# EAGLE design KeyBoy (EAGLE 9.5.2)

## Sheet 1 of 2
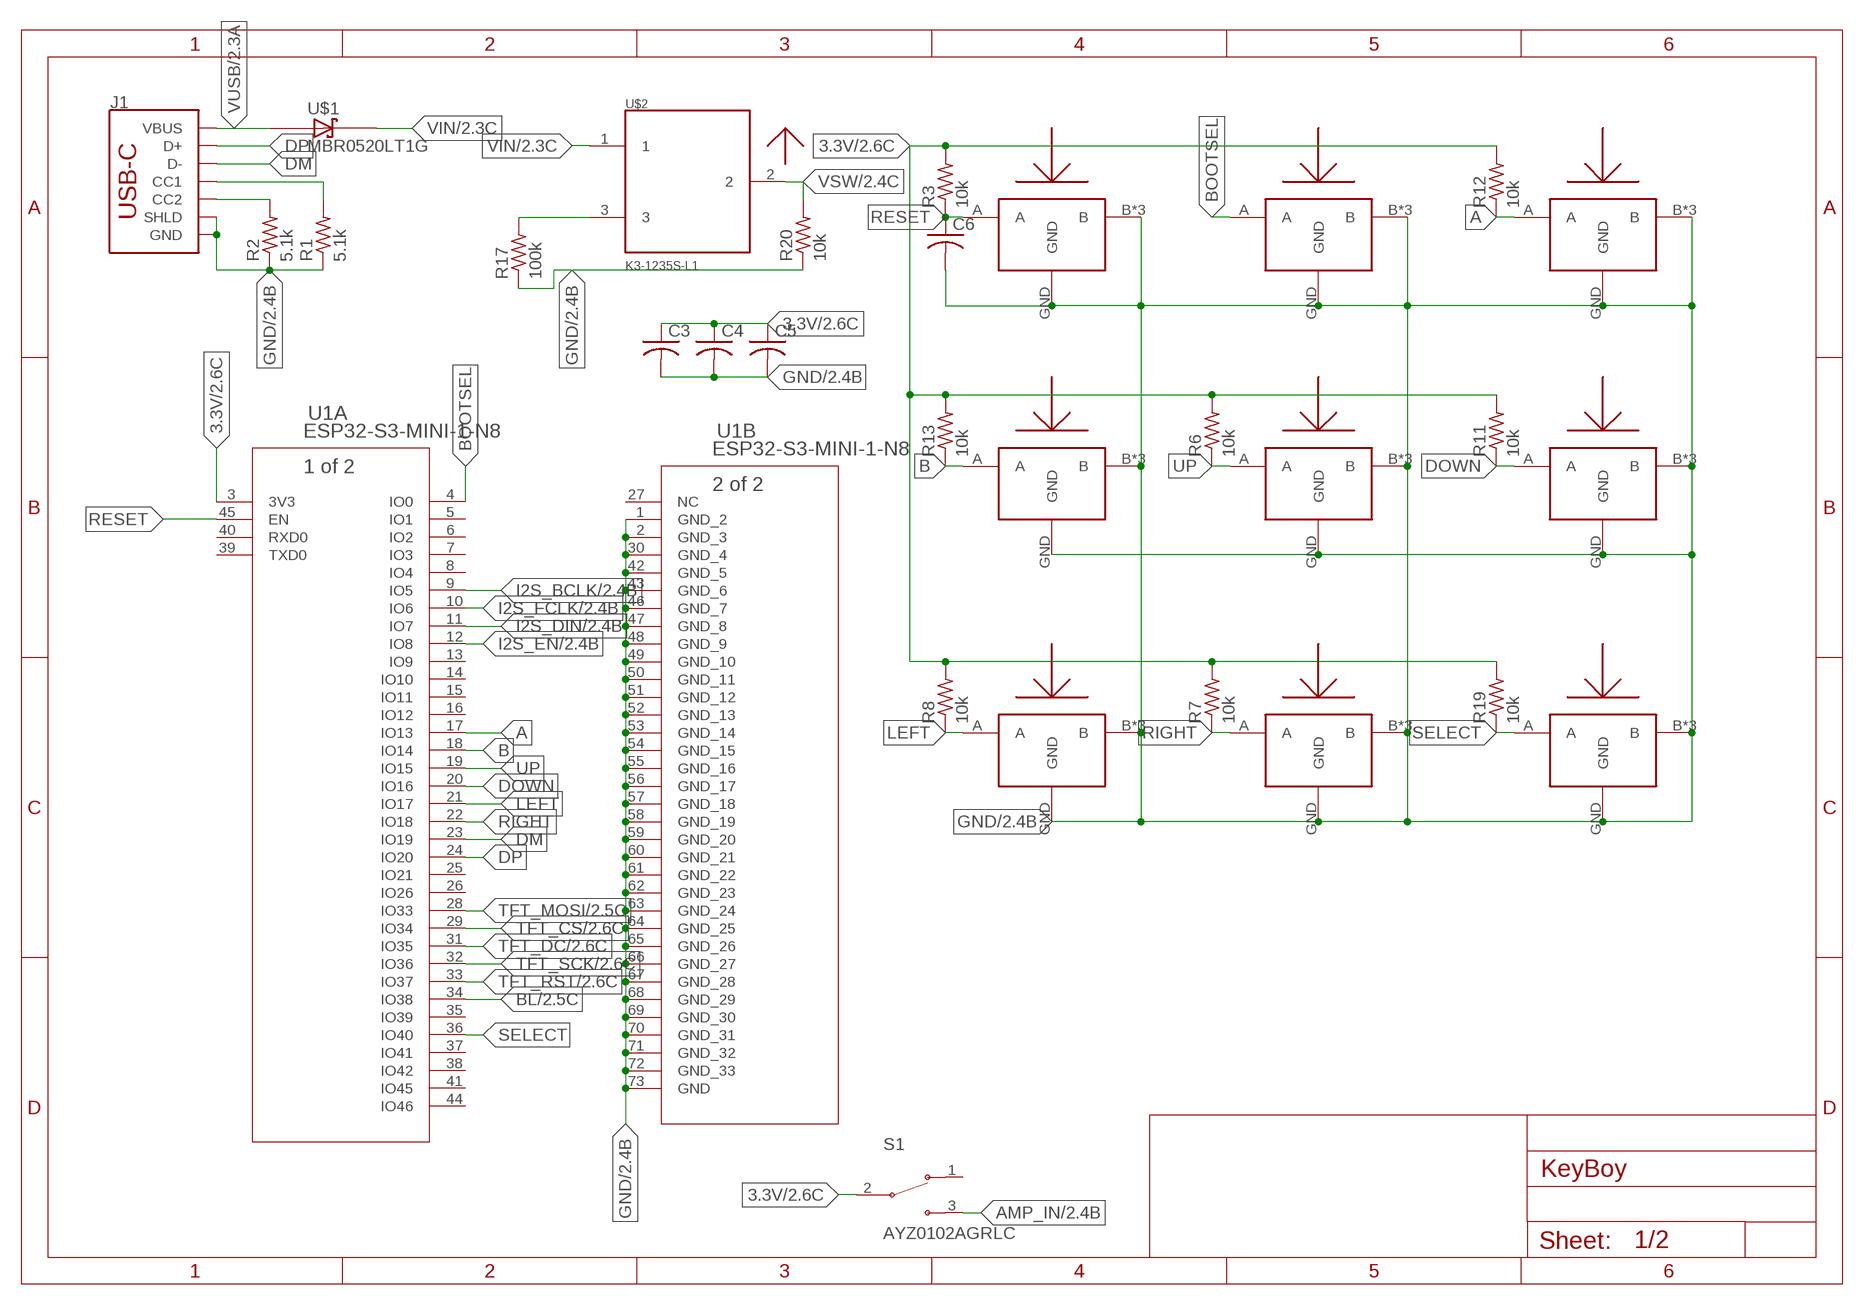
[diagram p0: schematic, sheet 1]

### Parts
A  SOF-232HST  [3.3X2.9]
B  SOF-232HST  [3.3X2.9]
BOOTSEL  SOF-232HST  [3.3X2.9]
C3  C-USC0402  [C0402]
C4  C-USC0402  [C0402]
C5  C-USC0402  [C0402]
C6  C-USC0402  [C0402]
DOWN  SOF-232HST  [3.3X2.9]
J1  USB_C_2-LAYER_PADS  [USB-C-16P-2LAYER-PADS]
LEFT  SOF-232HST  [3.3X2.9]
R1  5.1k  R-US_R0402  [R0402]
R2  5.1k  R-US_R0402  [R0402]
R3  10k  R-US_R0402  [R0402]
R6  10k  R-US_R0402  [R0402]
R7  10k  R-US_R0402  [R0402]
R8  10k  R-US_R0402  [R0402]
R11  10k  R-US_R0402  [R0402]
R12  10k  R-US_R0402  [R0402]
R13  10k  R-US_R0402  [R0402]
R17  100k  R-US_R0402  [R0402]
R19  10k  R-US_R0402  [R0402]
R20  10k  R-US_R0402  [R0402]
RESET  SOF-232HST  [3.3X2.9]
RIGHT  SOF-232HST  [3.3X2.9]
S1  AYZ0102AGRLC  [SW_AYZ0102AGRLC]
SELECT  SOF-232HST  [3.3X2.9]
U1  ESP32-S3-MINI-1-N8  ESP32-S2-MINI-1-N4  [ESP32-S2-MINI-1-N4_EXP]
U$1  MBR0520LT1G  [SOD3716X117(SOD-123)]
U$2  K3-1235S-L1  [K3-1235S-L1]
UP  SOF-232HST  [3.3X2.9]

### Nets
3.3V: C3.1 C4.1 C5.1 R3.2 R6.2 R7.2 R8.2 R11.2 R12.2 R13.2 R19.2 S1.2 U1.3(A:3V3) ; also sheet 2
A: A.A R12.1 U1.17(A:IO13)
AMP_IN: S1.3 ; also sheet 2
B: B.A R13.1 U1.18(A:IO14)
BL: U1.34(A:IO38) ; also sheet 2
BOOTSEL: BOOTSEL.A U1.4(A:IO0)
DM: J1.A7(D-) J1.B7(D-) U1.23(A:IO19)
DOWN: DOWN.A R11.1 U1.20(A:IO16)
DP: J1.A6(D+) J1.B6(D+) U1.24(A:IO20)
GND: A.B A.B2(B) A.B3(B) A.GND B.B B.B2(B) B.B3(B) B.GND BOOTSEL.B BOOTSEL.B2(B) BOOTSEL.B3(B) BOOTSEL.GND C3.2 C4.2 C5.2 C6.2 DOWN.B DOWN.B2(B) DOWN.B3(B) DOWN.GND J1.GND J1.GND2(GND) J1.P$1(SHLD) J1.P$2(SHLD) J1.P$3(SHLD) J1.P$4(SHLD) J1.SHLD1(SHLD) J1.SHLD2(SHLD) J1.SHLD3(SHLD) J1.SHLD4(SHLD) LEFT.B LEFT.B2(B) LEFT.B3(B) LEFT.GND R1.1 R2.1 R17.1 R20.1 RESET.B RESET.B2(B) RESET.B3(B) RESET.GND RIGHT.B RIGHT.B2(B) RIGHT.B3(B) RIGHT.GND SELECT.B SELECT.B2(B) SELECT.B3(B) SELECT.GND U1.1(B:GND_2) U1.2(B:GND_3) U1.30(B:GND_4) U1.42(B:GND_5) U1.43(B:GND_6) U1.46(B:GND_7) U1.47(B:GND_8) U1.48(B:GND_9) U1.49(B:GND_10) U1.50(B:GND_11) U1.51(B:GND_12) U1.52(B:GND_13) U1.53(B:GND_14) U1.54(B:GND_15) U1.55(B:GND_16) U1.56(B:GND_17) U1.57(B:GND_18) U1.58(B:GND_19) U1.59(B:GND_20) U1.60(B:GND_21) U1.61(B:GND_22) U1.62(B:GND_23) U1.63(B:GND_24) U1.64(B:GND_25) U1.65(B:GND_26) U1.66(B:GND_27) U1.67(B:GND_28) U1.68(B:GND_29) U1.69(B:GND_30) U1.70(B:GND_31) U1.71(B:GND_32) U1.72(B:GND_33) U1.73(B:GND) UP.B UP.B2(B) UP.B3(B) UP.GND ; also sheet 2
I2S_BCLK: U1.9(A:IO5) ; also sheet 2
I2S_DIN: U1.11(A:IO7) ; also sheet 2
I2S_EN: U1.12(A:IO8) ; also sheet 2
I2S_FCLK: U1.10(A:IO6) ; also sheet 2
LEFT: LEFT.A R8.1 U1.21(A:IO17)
N$3: J1.A5(CC1) R1.2
N$4: J1.B5(CC2) R2.2
N$6: R17.2 U$2.3
RESET: C6.1 R3.1 RESET.A U1.45(A:EN)
RIGHT: R7.1 RIGHT.A U1.22(A:IO18)
SELECT: R19.1 SELECT.A U1.36(A:IO40)
TFT_CS: U1.29(A:IO34) ; also sheet 2
TFT_DC: U1.31(A:IO35) ; also sheet 2
TFT_MOSI: U1.28(A:IO33) ; also sheet 2
TFT_RST: U1.33(A:IO37) ; also sheet 2
TFT_SCK: U1.32(A:IO36) ; also sheet 2
UP: R6.1 U1.19(A:IO15) UP.A
VIN: U$1.1(C) U$2.1 ; also sheet 2
VSW: R20.2 U$2.2 ; also sheet 2
VUSB: J1.VBUS1(VBUS) J1.VBUS2(VBUS) U$1.2(A) ; also sheet 2
Unconnected: S1.1 U1.5(A:IO1) U1.6(A:IO2) U1.7(A:IO3) U1.8(A:IO4) U1.13(A:IO9) U1.14(A:IO10) U1.15(A:IO11) U1.16(A:IO12) U1.25(A:IO21) U1.26(A:IO26) U1.27(B:NC) U1.35(A:IO39) U1.37(A:IO41) U1.38(A:IO42) U1.39(A:TXD0) U1.40(A:RXD0) U1.41(A:IO45) U1.44(A:IO46)

## Sheet 2 of 2
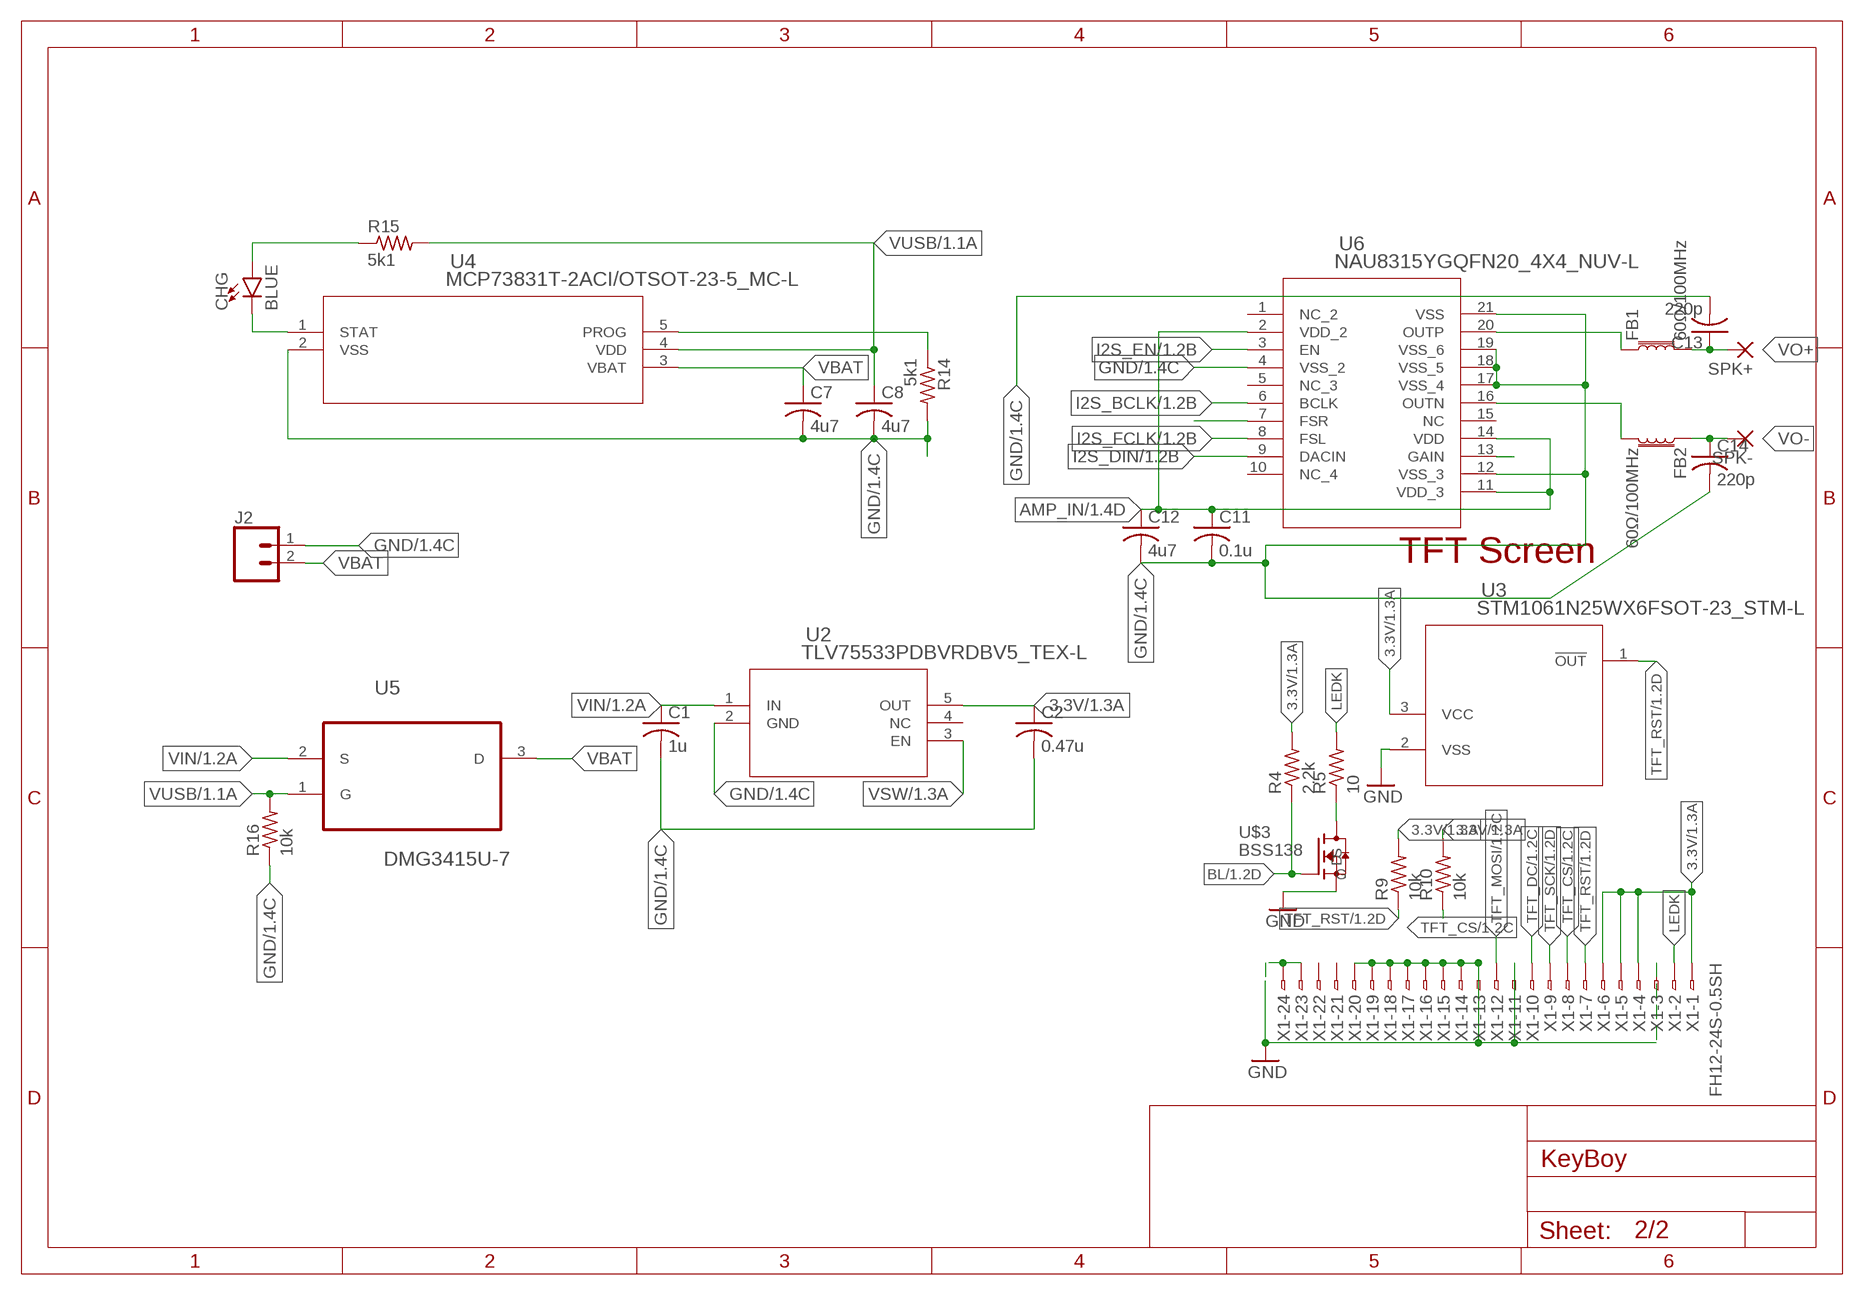
[diagram p1: schematic, sheet 2]

### Parts
C1  1u  C-USC0402  [C0402]
C2  0.47u  C-USC0402  [C0402]
C7  4u7  C-USC0603  [C0603]
C8  4u7  C-USC0603  [C0603]
C11  0.1u  C-USC0603  [C0603]
C12  4u7  C-USC0603  [C0603]
C13  220p  C-USC0603  [C0603]
C14  220p  C-USC0603  [C0603]
CHG  BLUE  LED0603  [LED-0603]
FB1  60Ω/100MHz  FERRITE_BEAD-0603  [0603]
FB2  60Ω/100MHz  FERRITE_BEAD-0603  [0603]
J2  CONN_02-JST-2MM-SMT  [JST-2-SMD]
R4  2.2k  R-US_R0603  [R0603]
R5  10  R-US_R0402  [R0402]
R9  10k  R-US_R0402  [R0402]
R10  10k  R-US_R0402  [R0402]
R14  5k1  R-US_R0603  [R0603]
R15  5k1  R-US_R0603  [R0603]
R16  10k  R-US_R0402  [R0402]
SPK+  SMD5  [SMD2,54-5,08]
SPK-  SMD5  [SMD2,54-5,08]
U2  TLV75533PDBVRDBV5_TEX-L  [DBV5_TEX-L]
U3  STM1061N25WX6FSOT-23_STM-L  [SOT-23_STM-L]
U4  MCP73831T-2ACI/OTSOT-23-5_MC-L  [SOT-23-5_MC-L]
U5  DMG3415U-7  [SOT95P240X105-3N]
U6  NAU8315YGQFN20_4X4_NUV-L  [QFN20_4X4_NUV-L]
U$3  BSS138  [BSS138]
X1  FH12-24S-0.5SH  [FH12-24S-0.5SH]

### Nets
3.3V: C2.1 R4.2 R9.2 R10.2 U2.5(OUT) U3.3(VCC) X1.1 X1.4 X1.5 X1.6 ; also sheet 1
AMP_IN: C11.1 C12.1 U6.2(VDD_2) U6.11(VDD_3) U6.14(VDD) ; also sheet 1
BL: R4.1 U$3.G ; also sheet 1
GND: C1.2 C2.2 C7.2 C8.2 C11.2 C12.2 C13.2 C14.2 J2.1 R14.2 R16.1 U2.2(GND) U3.2(VSS) U4.2(VSS) U6.4(VSS_2) U6.12(VSS_3) U6.17(VSS_4) U6.18(VSS_5) U6.19(VSS_6) U6.21(VSS) U$3.S X1.3 X1.11 X1.13 X1.14 X1.15 X1.16 X1.17 X1.18 X1.19 X1.20 X1.23 X1.24 ; also sheet 1
I2S_BCLK: U6.6(BCLK) ; also sheet 1
I2S_DIN: U6.9(DACIN) ; also sheet 1
I2S_EN: U6.3(EN) ; also sheet 1
I2S_FCLK: U6.8(FSL) ; also sheet 1
LEDK: R5.2 X1.2
N$1: R14.1 U4.5(PROG)
N$5: FB1.1 U6.20(OUTP)
N$7: R5.1 U$3.D
N$8: FB2.2 U6.16(OUTN)
N$9: CHG.C U4.1(STAT)
N$10: CHG.A R15.1
N$14: U6.7(FSR)
N$17: U6.13(GAIN)
TFT_CS: R10.1 X1.8 ; also sheet 1
TFT_DC: X1.10 ; also sheet 1
TFT_MOSI: X1.12 ; also sheet 1
TFT_RST: R9.1 U3.1(!OUT) X1.7 ; also sheet 1
TFT_SCK: X1.9 ; also sheet 1
VBAT: C7.1 J2.2 U4.3(VBAT) U5.3(D)
VIN: C1.1 U2.1(IN) U5.2(S) ; also sheet 1
VO+: C13.1 FB1.2 SPK+.1(P)
VO-: C14.1 FB2.1 SPK-.1(P)
VSW: U2.3(EN) ; also sheet 1
VUSB: C8.1 R15.2 R16.2 U4.4(VDD) U5.1(G) ; also sheet 1
Unconnected: U2.4(NC) U6.1(NC_2) U6.5(NC_3) U6.10(NC_4) U6.15(NC) X1.21 X1.22

### Notes on the sheet
- TFT Screen

## Library data of the parts
A B BOOTSEL DOWN LEFT RESET RIGHT SELECT UP = Mitsumi Buttons:SOF-232HST
C1-C8 C11-C14 = rcl:C-US: CAPACITOR, American symbol; SPICEPREFIX: C
CHG = SparkFun-LED:LED: LED (Generic) Standard schematic elements and footprints for 5mm, 3mm, 1206, and 0603 sized LEDs. Generic LEDs with no color specified.
FB1 FB2 = SparkFun-Coils:FERRITE_BEAD: Ferrite Bead (blocks, cores, rings, chokes, etc.) Inductor with layers of ferrite used to suppress high frequencies. Often used to isolate high frequency noise. SparkFun Products: IOIO-OTG - V2.2 <https://www.sparkfun.com/products/13613> SparkFun SAMD21 Mini Breakout <https://www.sparkfun.com/products/13664> SparkFun 6 Degrees of Freedom Breakout - LSM6DS3 <https://www.sparkfun.com/products/13339> SparkFun SAMD21 Dev Breakout <https://www.sparkfun.com/products/13672>; PROD_ID: NDUC-13805; VALUE: 30Ω/1.8A
J1 = SparkFun-Connectors:USB_C: USB Type C 16Pin Connector Super Speed pins not available on the 16-pin purely SMD connector so this part is best for USB 2.0 implementations. D1 and D2 are tied together enabling D+/- no matter which way the cable is plugged into the connector. The two channel configuration pins (CC1/2) are exposed. These are normally connected to ground via 5.1k resistors but can be reconfigured for high current/high power applications.; PROD_ID: CONN-14122
J2 = SparkFun-Connectors:CONN_02: Multi connection point. Often used as Generic Header-pin footprint for 0.1 inch spaced/style header connections On any of the 0.1 inch spaced packages, you can populate with these: Break Away Headers - Straight <https://www.sparkfun.com/products/116> (PRT-00116) Break Away Male Headers - Right Angle <https://www.sparkfun.com/products/553> (PRT-00553) Female Headers <https://www.sparkfun.com/products/115> (PRT-00115) Break Away Headers - Machine Pin <https://www.sparkfun.com/products/117> (PRT-00117) Break Away Female Headers - Swiss Machine Pin <https://www.sparkfun.com/products/743> (PRT-00743) For SCREWTERMINALS and SPRING TERMINALS visit here: Screw Terimnals on SparkFun.com <https://www.sparkfun.com/search/results?term=Screw+Terminals> (5mm/3.5mm/2.54mm spacing) This device is also useful as a general connection point to wire up your design to another part of your project. Our various solder wires solder well into these plated through hole pads. Hook-Up Wire - Assortment (Stranded, 22 AWG) <https://www.sparkfun.com/products/11375> (PRT-11375) Hook-Up Wire - Assortment (Solid Core, 22 AWG) <https://www.sparkfun.com/products/11367> (PRT-11367) View the entire wire category on our website here <https://www.sparkfun.com/categories/141> Special notes: Molex polarized connector foot print use with: PRT-08233 with associated crimp pins and housings. 2.54_SCREWTERM for use with PRT-10571. 3.5mm Screw Terminal footprints for PRT-08084 5mm Screw Terminal footprints for use with PRT-08432; PROD_ID: CONN-11443
R1-R17 R19 R20 = rcl:R-US_: RESISTOR, American symbol; SPICEPREFIX: R
S1 = AYZ0102AGRLC:AYZ0102AGRLC: Switch Slide ON ON SPDT Side Slide 0.1A 12VDC 1.2VA 10000Cycles Gull Wing SMD T/R Check availability <https://pricing.snapeda.com/parts/AYZ0102AGRLC/C%26K/view-part?ref=eda>; AVAILABILITY: In Stock; DESCRIPTION: Slide Switch SPDT Surface Mount, Right Angle; MF: C&K; MP: AYZ0102AGRLC; PACKAGE: None; PRICE: None; PURCHASE-URL: https://pricing.snapeda.com/search/part/AYZ0102AGRLC/?ref=eda
SPK+ SPK- = wirepad:SMD5: SMD PAD
U1 = ESP32-S2-MINI:ESP32-S2-MINI-1-N4; COPYRIGHT: Copyright (C) 2021 Ultra Librarian. All rights reserved.; DIGI-KEY_PART_NUMBER_1: 1965-ESP32-S2-MINI-1-N4-ND; MANUFACTURER_PART_NUMBER: ESP32-S2-MINI-1-N4; MFR_NAME: Espressif Systems
U2 = TLV75533pdbvr:TLV75533PDBVR; COPYRIGHT: Copyright (C) 2018 Accelerated Designs. All rights reserved; MANUFACTURER_PART_NUMBER: TLV75533PDBVR; SOURCELIBRARY: TI_2019-06-18; VENDOR: Texas Instruments
U3 = STM Devices:STM1061N25WX6F; COPYRIGHT: Copyright (C) 2021 Ultra Librarian. All rights reserved.; DIGI-KEY_PART_NUMBER_1: 1026-STM1061N25WX6F-CHP; DIGI-KEY_PART_NUMBER_2: 497-6181-1-ND; DIGI-KEY_PART_NUMBER_3: 497-6181-2-ND; DIGI-KEY_PART_NUMBER_4: 497-6181-6-ND; MANUFACTURER_PART_NUMBER: STM1061N25WX6F; MFR_NAME: STMicroelectronics
U4 = MCP73831-2ACI:MCP73831T-2ACI/OT; BUILT_BY: EMA_UL_Team; MANUFACTURER_PART_NUMBER: MCP73831T-2ACI/OT; VENDOR: Microchip
U5 = DMG3415U-7:DMG3415U-7: P-CHANNEL ENHANCEMENT MODE MOSFET; AVAILABILITY: Unavailable; DESCRIPTION: P-Channel 20V 4A _Ta_ 900mW _Ta_ Surface Mount SOT-23-3; MF: Diodes Inc.; MP: DMG3415U-7; PACKAGE: SOT-23-3 Diodes Inc.; PRICE: None
U6 = NAU8315YG:NAU8315YG; COPYRIGHT: Copyright (C) 2023 Ultra Librarian. All rights reserved.; MANUFACTURER_PART_NUMBER: NAU8315YG; MFR_NAME: Nuvoton
U$1 = MBR0520LT1G:MBR0520LT1G: Surface Mount Schottky Power Rectifier Plastic SOD−123 Package; AVAILABILITY: Unavailable; DESCRIPTION: Diode Schottky 20V 500mA Surface Mount SOD-123; MF: ON Semiconductor; MP: MBR0520LT1G; PACKAGE: SOD-123 ON Semiconductor; PRICE: None
U$2 = KS Switches:K3-1235S-L1
U$3 = BSS138:BSS138: BSS138 N-Channel Logic Level Enhancement Mode Field Effect Transistor; AVAILABILITY: Unavailable; DESCRIPTION: N-Channel 50V 220mA _Ta_ 360mW _Ta_ Surface Mount Die; MF: MICROSS/On Semiconductor; MP: BSS138; PACKAGE: TO-236-3 Micross; PRICE: None
X1 = con-hirose:FH12-24S-0.5S: 0.5mm Pitch Connectors For FPC/FFC Source: Data sheet <http://www.hirose.co.jp/cataloge_hp/e58605370.pdf>; MPN: FH12-24S-0.5SH(55); OC_FARNELL: 1324552; OC_NEWARK: 34M6170

## Board
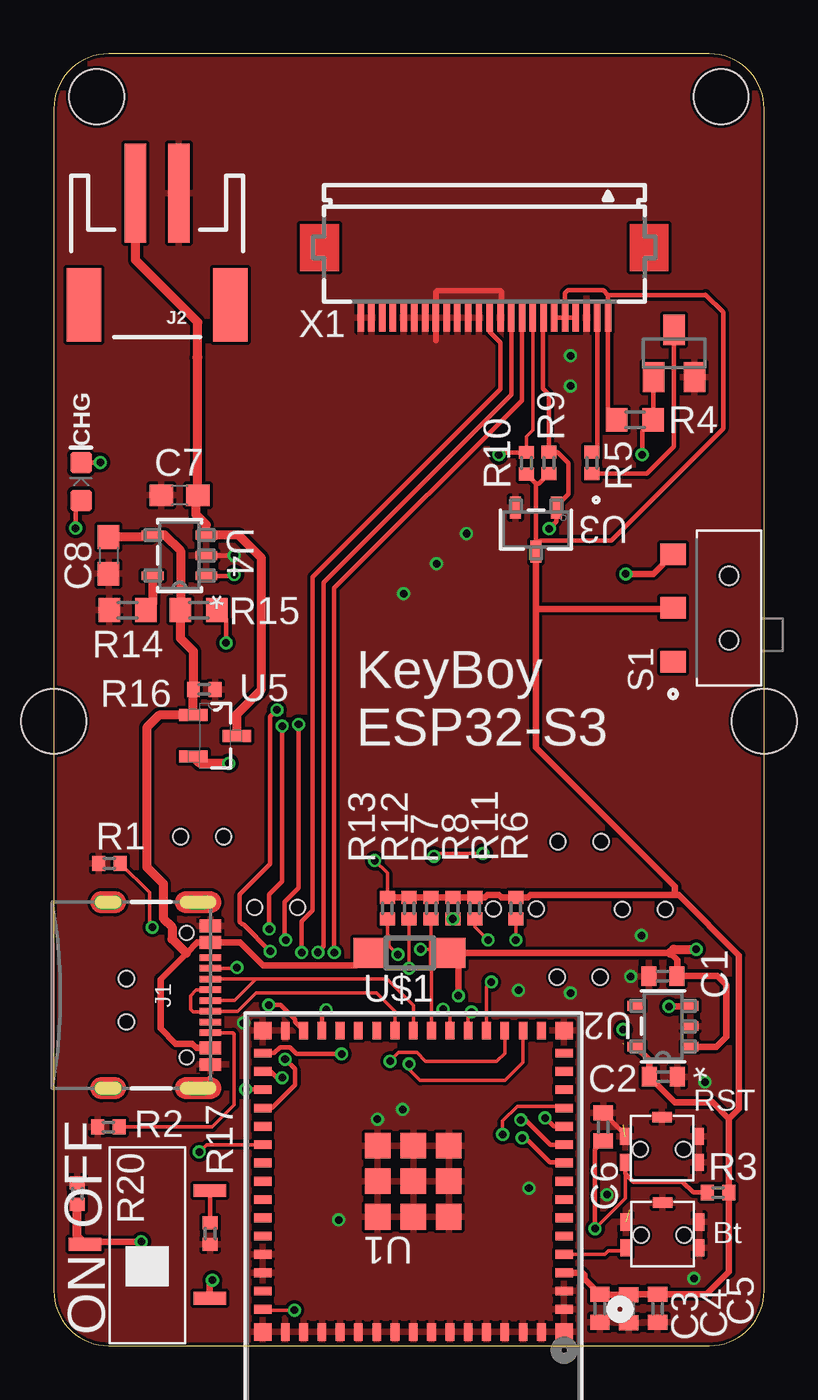
[diagram p2: board, top side]
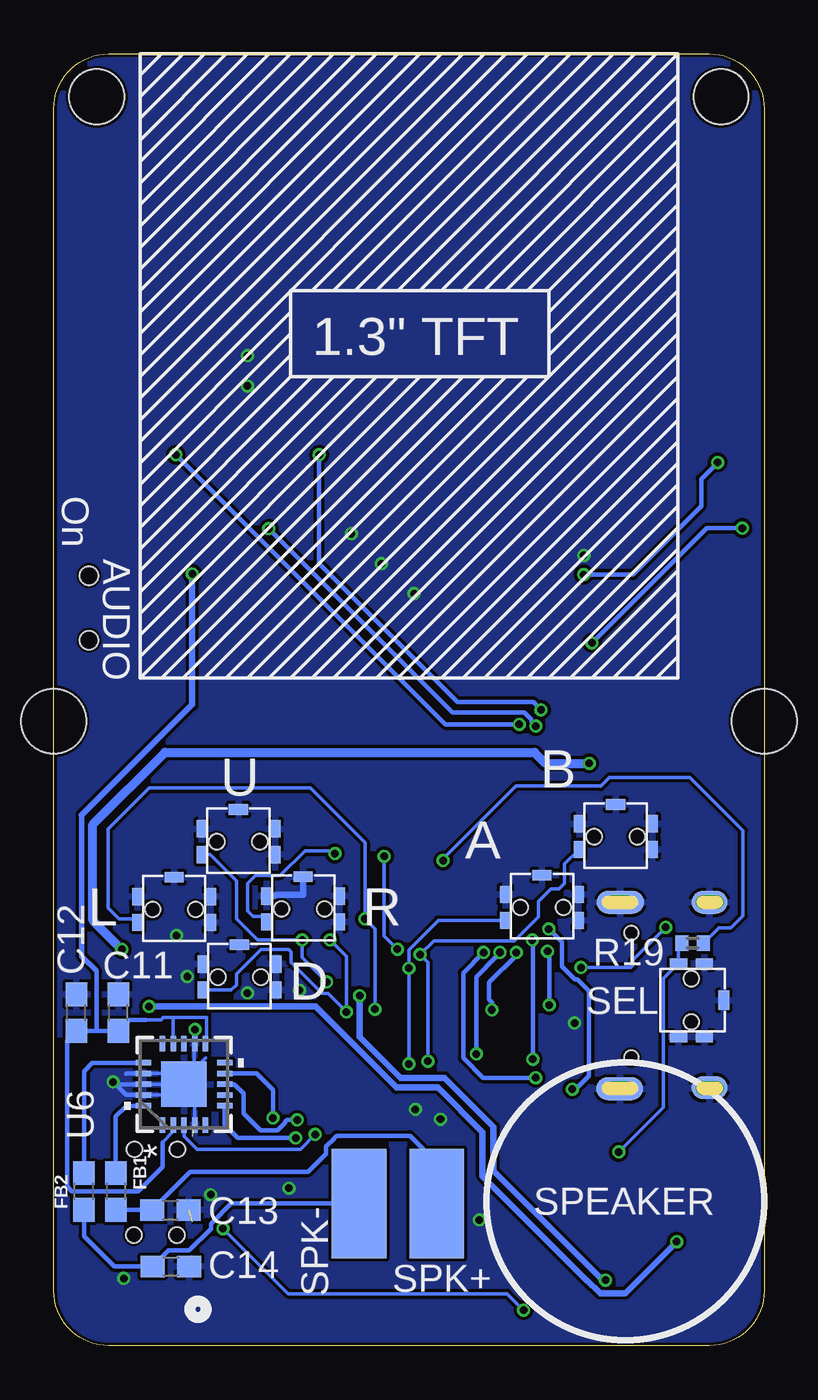
[diagram p3: board, bottom side, seen from below]

Size 33 x 60 mm. Coordinates in mm from the lower left corner, seen from the top.
Outline: 0,57.46 0,2.54 arc90 2.54,0 30.46,0 arc90 33,2.54 33,57.46 arc90 30.46,60 2.54,60 arc90 0,57.46
Copper layers (1*16): Top 0.035mm / dielectric 1.5mm / Bottom 0.035mm
Design rules "default *": minimum track width 6mil, minimum drill 0.35mm, track to track 6mil, track to pad 6mil, pad to pad 6mil, via to via 6mil, smd to smd 6mil, copper to edge 6mil, drill to drill 6mil, minimum pad ring 5mil, minimum via ring 5mil, stop-mask expansion 1mil, vias tented up to drill 14mil, thermal gap 6mil
Holes 2.54 mm at 2,58 31,58
Holes 3 mm at 0,29 33,29

### Footprints (pad centres in the part's own frame; a part is rotated, then mirrored left to right if it is on the bottom)
3.3X2.9 = smd 0.5 x 0.8: A -0.7,-0.6; B2 2.7,0.6; B3 2.7,-0.6; GND -0.7,0.6 | smd 0.9 x 0.5: B 1,1.5 | hole 0.7: 0,0; 2,0
C0402 = smd 0.7 x 0.9: 1 -0.65,0; 2 0.65,0
C0603 = smd 1.1 x 1: 1 -0.85,0; 2 0.85,0
LED-0603 = smd 1 x 1: A -0.877,0; C 0.877,0
0603 = smd 1.1 x 1: 1 -0.85,0; 2 0.85,0
USB-C-16P-2LAYER-PADS = smd 0.3 x 1: A5 -1.25,-0.34; A6 -0.25,-0.34; A7 0.25,-0.34; A8 1.25,-0.34; B5 1.75,-0.34; B6 0.75,-0.34; B7 -0.75,-0.34; B8 -1.75,-0.34 | smd 0.6 x 1: GND -3.225,-0.34; GND2 3.225,-0.34; VBUS1 -2.45,-0.34; VBUS2 2.45,-0.34 | smd 1.067 x 2.184 bottom: P$1 -4.318,-0.94; P$2 4.343,-0.914 | smd 1.067 x 1.676 bottom: P$3 -4.318,-5.08; P$4 4.293,-5.08 | drill 0.4 pad 0.6 long: SHLD1 -4.318,-0.915; SHLD2 4.318,-0.915; SHLD3 -4.318,-5.095; SHLD4 4.318,-5.095 | hole 0.65: -2.89,-1.445; 2.89,-1.445
JST-2-SMD = smd 1 x 4.6: 1 -1,-3.7; 2 1,-3.7 | smd 1.6 x 3.4: NC1 -3.4,1.5; NC2 3.4,1.5
R0402 = smd 0.6 x 0.7: 1 -0.5,0; 2 0.5,0
R0603 = smd 1 x 1.1: 1 -0.85,0; 2 0.85,0
SW_AYZ0102AGRLC = smd 1 x 1.2: 1 -2.5,2.45; 2 0,2.45; 3 2.5,2.45 | hole 0.85: -1.5,-0.15; 1.5,-0.15
SMD2,54-5,08 = smd 2.54 x 5.08: 1 0,0
ESP32-S2-MINI-1-N4_EXP = smd 0.813 x 0.406: 1 -7,3.661; 2 -7,2.811; 3 -7,1.961; 4 -7,1.111; 5 -7,0.261; 6 -7,-0.589; 7 -7,-1.439; 8 -7,-2.289; 9 -7,-3.139; 10 -7,-3.989; 11 -7,-4.839; 12 -7,-5.689; 13 -7,-6.539; 14 -7,-7.389; 15 -7,-8.239; 31 7,-8.239; 32 7,-7.389; 33 7,-6.539; 34 7,-5.689; 35 7,-4.839; 36 7,-3.989; 37 7,-3.139; 38 7,-2.289; 39 7,-1.439; 40 7,-0.589; 41 7,0.261; 42 7,1.111; 43 7,1.961; 44 7,2.811; 45 7,3.661 | smd 0.406 x 0.813: 16 -5.95,-9.289; 17 -5.1,-9.289; 18 -4.25,-9.289; 19 -3.4,-9.289; 20 -2.55,-9.289; 21 -1.7,-9.289; 22 -0.85,-9.289; 23 0,-9.289; 24 0.85,-9.289; 25 1.7,-9.289; 26 2.55,-9.289; 27 3.4,-9.289; 28 4.25,-9.289; 29 5.1,-9.289; 30 5.95,-9.289; 46 5.95,4.711; 47 5.1,4.711; 48 4.25,4.711; 49 3.4,4.711; 50 2.55,4.711; 51 1.7,4.711; 52 0.85,4.711; 53 0,4.711; 54 -0.85,4.711; 55 -1.7,4.711; 56 -2.55,4.711; 57 -3.4,4.711; 58 -4.25,4.711; 59 -5.1,4.711; 60 -5.95,4.711 | smd 1.194 x 1.194: 61 0,-2.289; 66 -1.65,-0.639; 67 0,-0.639; 68 1.65,-0.639; 69 -1.65,-2.289; 70 1.65,-2.289; 71 -1.65,-3.939; 72 0,-3.939; 73 1.65,-3.939 | smd 0.813 x 0.813: 62 -7,4.711; 63 -7,-9.289; 64 7,-9.289; 65 7,4.711
DBV5_TEX-L = smd 0.775 x 0.457: 1 -1.264,0.95; 2 -1.264,0; 3 -1.264,-0.95; 4 1.264,-0.95; 5 1.264,0.95
SOT-23_STM-L = smd 0.508 x 1.016: 1 -0.95,-1.016; 2 0.95,-1.016; 3 0,1.016
SOT-23-5_MC-L = smd 1.016 x 0.406: 1 -1.245,0.95; 2 -1.245,0; 3 -1.245,-0.95; 4 1.245,-0.95; 5 1.245,0.95
SOT95P240X105-3N = smd 1.321 x 0.559: 1 -1.016,0.965; 2 -1.016,-0.965; 3 1.016,0
QFN20_4X4_NUV-L = smd 0.711 x 0.254: 1 -1.892,1; 2 -1.892,0.5; 3 -1.892,0; 4 -1.892,-0.5; 5 -1.892,-1; 11 1.892,-1; 12 1.892,-0.5; 13 1.892,0; 14 1.892,0.5; 15 1.892,1 | smd 0.254 x 0.711: 6 -1,-1.892; 7 -0.5,-1.892; 8 0,-1.892; 9 0.5,-1.892; 10 1,-1.892; 16 1,1.892; 17 0.5,1.892; 18 0,1.892; 19 -0.5,1.892; 20 -1,1.892 | smd 2.108 x 2.108: 21 0,0
SOD3716X117(SOD-123) = smd 1.4 x 1.4: 1 -1.9,0.051; 2 1.9,0.051
K3-1235S-L1 = smd 1.5 x 0.6: 1 -3.5,2.5; 2 2.3,0; 3 -3.5,-2.5
BSS138 = smd 1 x 1.4: D 0,1.1; G -0.95,-1.1; S 0.95,-1.1
FH12-24S-0.5SH = smd 0.3 x 1.3: 1 -5.75,3.25; 2 -5.25,3.25; 3 -4.75,3.25; 4 -4.25,3.25; 5 -3.75,3.25; 6 -3.25,3.25; 7 -2.75,3.25; 8 -2.25,3.25; 9 -1.75,3.25; 10 -1.25,3.25; 11 -0.75,3.25; 12 -0.25,3.25; 13 0.25,3.25; 14 0.75,3.25; 15 1.25,3.25; 16 1.75,3.25; 17 2.25,3.25; 18 2.75,3.25; 19 3.25,3.25; 20 3.75,3.25; 21 4.25,3.25; 22 4.75,3.25; 23 5.25,3.25; 24 5.75,3.25

### Placement (x,y rotation side)
A  11.32,20.35 0 bottom
B  7.89,23.64 0 bottom
BOOTSEL  27.28,5.14 0 top
C1  28.29,17.16 180 top
C2  28.31,12.49 0 top
C3  25.37,1.73 270 top
C4  26.71,1.72 270 top
C5  28.05,1.73 270 top
C6  25.53,10.16 90 top
C7  5.84,39.5 180 top
C8  2.54,36.7 270 top
C11  30,15.47 90 bottom
C12  31.95,15.47 90 bottom
C13  27.58,6.3 0 bottom
C14  27.56,3.68 0 bottom
CHG  1.27,40.13 90 top
DOWN  25.38,17.12 0 bottom
FB1  30.12,7.16 270 bottom
FB2  31.6,7.16 90 bottom
J1  7.62,16.28 270 top
J2  4.8,49.83 180 top
LEFT  28.41,20.26 0 bottom
R1  2.59,22.4 0 top
R2  2.54,10.16 0 top
R3  30.86,7.11 0 top
R4  27,43 180 top
R5  25,41 90 top
R6  21.46,20.32 90 top
R7  17.53,20.32 90 top
R8  18.54,20.32 90 top
R9  23,41 270 top
R10  21.96,40.99 270 top
R11  19.56,20.32 90 top
R12  16.51,20.32 90 top
R13  15.49,20.32 90 top
R14  3.43,34.16 180 top
R15  6.73,34.16 180 top
R16  6.99,30.48 180 top
R17  7.26,5.21 90 top
R19  3.33,18.69 0 bottom
R20  1.09,7.06 270 top
RESET  27.25,9.12 0 top
RIGHT  22.42,20.28 0 bottom
S1  31.22,34.26 90 top
SELECT  3.38,17.04 270 bottom
SPK+  15.21,6.6 0 bottom
SPK-  18.82,6.6 0 bottom
U1  16.7,5.35 180 top
U2  28.3,14.84 180 top
U3  22.4,37.9 180 top
U4  5.84,36.7 180 top
U5  7.49,28.32 0 top
U6  26.95,12.14 90 bottom
U$1  16.53,18.29 180 top
U$2  3.75,4.7 180 top
U$3  28.81,46.08 0 top
UP  25.42,23.41 0 bottom
X1  20,51 180 top

### Tracks (layer width: path | path; a pad name or v marks a point on that pad's centre or on a via)
3.3V  (via drill 0.35)
  Top 0.152: v14.91,22.53 15.49,21.95 R13.2
  Top 0.203: R4.2 25.75,43.4 X1.1 25.75,48.8 | X1.5 23.75,48.9 23.88,49.02 25.53,49.02 25.75,48.8 | X1.6 X1.5 | X1.5 X1.4 | U3.3 22.4,37.19 | 22.4,37.19 22.4,39.37 22.4,40.05 | 22.4,40.05 R10.2 | R9.2 22.55,40.05 22.4,40.05 | 25.75,48.8 30.26,48.8 30.28,48.82 31.1,47.99 31.1,42.58 25.91,37.39 22.61,37.39 22.4,37.19
  Top 0.305: U2.5 27.66,13.26 C2.1 28.85,11.3 30.61,11.3 31.37,10.54 | 31.37,10.54 31.37,7.09 31.37,3.43 30.32,2.38 C5.1 26.72,2.38 C4.1 25.38,2.37 C3.1 24.64,3.12 24.64,3.3 24.55,3.39 U1.3 | 31.37,10.54 31.83,11 31.83,18.14 29.02,20.94 28.86,20.94 | 28.86,20.94 22.15,20.94 22.03,20.82 R6.2 20.81,20.82 20.69,20.94 20.15,20.94 20.03,20.82 R11.2 R8.2 R7.2 R12.2 R13.2 | 28.86,20.94 28.86,21.33 22.4,27.79 22.4,34.21 | 22.4,34.21 U3.3 | S1.2 28.72,34.21 22.4,34.21
  Top 0.406: R3.2 31.37,7.09
  Bottom 0.152: R19.2 2.12,19.41 1.55,19.41 0.99,19.96 0.99,23.93 3.45,26.39 7.19,26.39 7.59,25.98 11.53,25.98 14.91,22.61 v14.91,22.53
A  (via drill 0.35)
  Top 0.152: U1.17 21.8,13.16 20.95,12.32 17.02,12.32 16.51,12.83 v16.51,13.08 | v16.51,17.53 R12.1
  Bottom 0.152: v16.51,13.08 v16.51,17.53 16.51,18.38 15.14,19.75 A.A
AMP_IN  (via drill 0.35)
  Top 0.305: S1.3 27.84,35.84 v26.57,35.84
  Bottom 0.152: 28.7,15.14 28.02,15.14 27.91,15.24 27.46,15.24 | 27.94,9.45 27.45,9.94 U6.2 | U6.11 25.91,14.07 25.91,15.24 27.46,15.24 | 27.46,15.24 27.45,15.23 U6.14
  Bottom 0.203: 28.7,15.14 29.48,15.14 C11.1 31.01,14.62 | 31.01,14.62 C12.1 32.38,14.19 32.38,7.39 32.16,7.17 29.08,7.17 27.94,8.3 27.94,9.45 | 31.01,14.62 31.01,17.4 31.06,17.45
  Bottom 0.254: 31.06,17.45 31.7,18.09 31.7,24.64
  Bottom 0.305: v26.57,35.84 26.57,29.77 31.7,24.64
B  (via drill 0.35)
  Top 0.152: U1.18 20.95,13.58 20.57,13.21 17.27,13.21 16.87,13.61 16.02,13.61 v15.62,13.21 | v15.98,18.16 15.56,18.58 15.56,19.03 15.49,19.1 R13.1
  Bottom 0.152: v15.62,13.21 15.62,17.8 v15.98,18.16 15.34,18.8 11.61,18.8 10.49,19.91 10.49,20.62 9.91,21.21 9.53,21.21 9.27,21.46 9.27,22.36 B.A
BL  (via drill 0.35)
  Top 0.203: U$3.G 27.86,43.01 R4.1 27.33,42.48 v27.33,41.38 | v11.37,28.85 11.37,21.26 10.72,20.6 10.72,18.9 v10.77,18.84 | U1.34 9.71,11.05 10.13,11.05 11.2,12.12 11.2,12.85 v10.74,13.31
  Bottom 0.203: v27.33,41.38 14.81,28.85 v11.37,28.85 | v10.74,13.31 10.74,18.82 v10.77,18.84
BOOTSEL
  Top 0.152: U1.4 25.6,4.24 25.76,4.4 26.44,4.4 BOOTSEL.A
DM
  Top 0.152: U1.23 16.7,15.81 15.48,17.03 9.53,17.03 9.41,17.03 | 9.41,17.03 J1.B7 | J1.A7 8.41,16.03 9.41,17.03
DOWN  (via drill 0.35)
  Top 0.152: U1.20 19.25,15.34 v19.4,15.49 | v20.17,18.84 19.56,19.46 R11.1
  Bottom 0.152: v20.17,18.84 19.4,18.07 v19.4,15.49 20.27,16.36 20.54,16.36 21.97,17.79 21.97,18.29 22.1,18.41 23.37,18.41 24.51,17.27 24.51,16.76 24.75,16.52 DOWN.A
DP
  Top 0.152: U1.24 15.85,15.52 14.99,16.38 9.4,16.38 8.54,15.53 J1.B6 7.25,15.49 6.48,15.49 6.35,15.62 6.35,16.26 6.62,16.53 J1.A6
GND  (via drill 0.35)  (3 unrouted)
  Top 0.152: J1.GND2 7.28,12.54 J1.SHLD2
  Top 0.203: C6.2 26.55,9.78 RESET.GND | U4.2 v8.38,36.7
  Top 0.254: X1.11 20.8,47.8 20.8,48.92 20.73,49 17.8,49 17.75,48.94 X1.17 17.75,46.69
  Bottom 0.152: 26.49,13.99 26.49,12.83 | 26.49,12.83 26.49,12.6 26.86,12.23 26.45,11.82 U6.4 | 25.95,13.37 26.49,12.83 | U6.17 28.28,12.64 28.27,12.65 27.46,12.65 27.06,12.26 | 27.06,12.26 U6.21 | U6.18 27.43,12.14 | 27.43,12.14 27.18,12.14 27.06,12.26 | U6.19 27.93,11.64 27.43,12.14
  Bottom 0.203: U6.12 26.45,14.64 26.47,14.66 | U6.17 29.62,12.64 29.64,12.62 | U6.18 30.15,12.14 v30.25,12.24 29.65,11.64 U6.19
  Bottom 0.305: RIGHT.GND 22.74,20.88 22.69,20.94 21.42,20.94 RIGHT.B
  other vias: 21.59,16.51 16.21,10.97 15.04,10.52 13.23,5.84 8.81,14.99 26.8,17.14 27.3,19.05 25.7,7.01 29.74,3.12 24,16.38 24,45.97 24,44.58 16.26,34.92 17.78,36.32 19.18,37.72 22.07,7.32
  pour Top: 35.56,62.23 -2.54,62.23 -2.54,-2.54 35.56,-2.54
  pour Bottom: 36.83,64.14 -3.81,64.14 -3.81,-3.81 36.83,-3.81
I2S_BCLK  (via drill 0.35)
  Top 0.203: U1.9 23.66,8.53 23.04,8.53 21.91,9.65 v21.76,9.65
  Bottom 0.203: v21.76,9.65 24.46,9.65 25.06,10.25 U6.6
I2S_DIN  (via drill 0.35)
  Top 0.203: U1.11 23.24,10.19 23.23,10.2 23.2,10.2 v22.82,10.58
  Bottom 0.203: v22.82,10.58 22.82,11.87 23.59,12.64 U6.9
I2S_EN  (via drill 0.35)
  Top 0.152: U1.12 23.62,11.12 21.53,11.12 20.85,10.44 v20.85,9.8
  Bottom 0.152: U6.3 26.95,9.73 26.34,9.12 21.54,9.12 v20.85,9.8
I2S_FCLK  (via drill 0.35)
  Top 0.203: U1.10 23.69,9.32 23.06,9.32 21.9,10.48 v21.69,10.48
  Bottom 0.203: v21.69,10.48 22.17,10.48 22.27,10.39 22.27,10.35 22.61,10.01 23.39,10.01 24.18,10.79 24.18,11.71 24.61,12.14 U6.8
LEDK
  Top 0.203: R5.2 25.25,41.75 X1.2
LEFT  (via drill 0.35)
  Top 0.152: U1.21 18.4,15.3 v18.08,15.62
  Bottom 0.152: v18.08,15.62 18.08,19.36 R8.1 18.54,23.37 21.08,25.91 28.57,25.91 30.48,24 30.48,20.32 29.97,19.81 29.27,19.81 LEFT.A
  other vias: 18.54,19.82
N$1
  Top 0.406: U4.5 4.6,34.48 R14.1
N$2  (via drill 0.35)
  other vias: 26.44,14.68
N$3  (via drill 0.35)
  Top 0.152: R1.2 4.45,21.05 4.45,19.56 v4.57,19.43 | v8.51,17.56 8.48,17.53 J1.A5
  Bottom 0.152: v4.57,19.43 6.1,17.91 6.1,17.65 6.19,17.56 v8.51,17.56
N$4
  Top 0.152: J1.B5 8.33,14.53 8.38,14.48 8.38,11.18 7.36,10.16 R2.2
N$5
  Bottom 0.203: U6.20 29.63,11.14 30.12,10.64 FB1.1
N$6
  Top 0.203: U$2.3 7.26,7.19 R17.2
N$7
  Top 0.203: U$3.D 28.81,41.77 27.55,40.5 R5.1
N$8
  Bottom 0.203: U6.16 31.21,13.14 31.6,12.75 FB2.2
N$9  (via drill 0.35)
  Top 0.203: CHG.C 1.28,41.02 v2.16,41.02 | v8.38,35.81 8.32,35.75 U4.1
  Bottom 0.203: v2.16,41.02 2.92,40.26 2.92,38.99 6.1,35.81 v8.38,35.81
N$10  (via drill 0.35)
  Top 0.203: R15.1 8,33.74 v8,32.64 | v1.02,37.97 1.02,39 CHG.A
  Bottom 0.203: v8,32.64 2.67,37.97 v1.02,37.97
RESET  (via drill 0.35)
  Top 0.152: RESET.A 26.55,6.84 v25.15,5.44 | v11.18,1.65 9.74,1.65 U1.45
  Top 0.203: R3.1 29.72,7.11 29.21,7.62 26.92,7.62 26.55,7.99 RESET.A | v25.15,5.44 25.15,9.13 C6.1
  Bottom 0.152: v25.15,5.44 22.12,2.41 11.94,2.41 v11.18,1.65
RIGHT  (via drill 0.35)
  Top 0.152: U1.22 17.55,17.4 17.51,17.44 17.51,18.41 | 17.51,18.41 17.51,19.03 17.53,19.05 R7.1 | v19.94,22.86 17.78,22.86 v17.65,22.73 | v17.04,18.41 17.51,18.41
  Bottom 0.152: RIGHT.A 23.38,19.94 23.75,19.94 24,20.19 24,21.46 23.62,21.84 22.48,21.84 21.34,22.99 20.07,22.99 v19.94,22.86 | v17.65,22.73 17.65,19.03 v17.04,18.41
SELECT  (via drill 0.35)
  Top 0.152: U1.36 7.1,9.34 v6.76,8.99
  Bottom 0.152: R19.1 3.98,18.54 SELECT.A 4.67,17.05 4.67,11.07 v6.76,8.99
TFT_CS  (via drill 0.35)
  Top 0.152: X1.8 22.25,42.52 21.96,42.23 R10.1
  Top 0.203: U1.29 11.21,15.03 11.21,15.15 10.53,15.82 v9.98,15.82 | v10.06,18.31 8.81,19.56 8.76,19.56 8.64,19.68 8.64,20.95 10.06,22.38 10.06,28.55 10.06,29.23 v10.36,29.54 | v20.68,41.38 20.79,41.49 R10.1
  Bottom 0.203: v9.98,15.82 9.98,18.24 v10.06,18.31 | v10.36,29.54 10.72,29.9 14.25,29.9 20.68,36.32 v20.68,41.38
TFT_DC  (via drill 0.35)
  Top 0.203: X1.10 21.25,44.16 12.52,35.43 12.52,18.54 12.47,18.49 12.47,18.47 v12.27,18.27 | v13.37,13.55 11.29,13.55 10.97,13.86 10.51,13.86 10.24,13.59 U1.31
  Bottom 0.203: v12.27,18.27 12.47,18.07 12.47,18.03 13.37,17.13 v13.37,13.55
TFT_MOSI  (via drill 0.35)
  Top 0.203: X1.12 20.24,47.1 20.75,46.59 20.75,44.42 12.03,35.7 12.03,20.2 11.52,19.7 v11.52,18.26 | U1.28 12.45,15.4 v12.65,15.6
  Bottom 0.203: v12.65,15.6 12.65,15.95 12.78,16.08 12.78,16.87 11.52,18.12 v11.52,18.26
TFT_RST  (via drill 0.35)
  Top 0.203: X1.7 22.73,47.73 22.73,44.45 23,44.18 R9.1 23.4,41.5 23.9,41 23.9,39.55 23.35,39 U3.1 23.35,38.28 v23.01,37.95 | v10.61,28.78 10.61,21.56 10.01,20.95 v10.01,19.36 | v8.91,11.91 9.68,11.91 U1.33
  Bottom 0.203: v10.61,28.78 10.81,28.98 10.81,29.09 11.14,29.41 14.48,29.41 v23.01,37.95 | v10.01,19.36 9.4,18.75 9.4,17.61 8.79,17 8.67,17 8.15,16.48 8.15,12.52 8.76,11.91 v8.91,11.91
TFT_SCK  (via drill 0.35)
  Top 0.203: X1.9 21.75,43.9 13.03,35.18 v13.03,18.26 | U1.32 10.08,12.74 10.37,12.45 v10.61,12.45
  Bottom 0.203: v13.03,18.26 13.97,17.32 13.97,13.36 13.06,12.45 v10.61,12.45
UP  (via drill 0.35)
  Top 0.152: U1.19 20.1,16.67 v20.32,16.89 | v21.46,18.84 R6.1
  Bottom 0.152: v20.32,16.89 21.46,18.03 v21.46,18.84 23.54,18.84 24.51,19.81 24.51,21.59 25.73,22.81 UP.A
VBAT
  Top 0.406: U5.3 8.51,29.34 9.65,30.48 9.65,36.58 8.57,37.65 U4.3 7.09,38.12 6.6,38.61 6.6,39.41 C7.1 6.69,45.9 | 6.69,45.9 6.66,45.9 | 6.69,45.9 6.69,47.54 3.8,50.43 J2.2
VIN  (via drill 0.35)
  Top 0.305: 28.96,17.18 28.96,17.91 28.62,18.24 U$1.1 18.8,17.88 v18.8,16.26 | 28.96,17.18 C1.1 | U2.1 30.78,13.89 31.24,14.35 31.24,16.76 30.83,17.18 28.96,17.18 | U$2.1 7.25,2.93 v7.37,3.05
  Top 0.406: 28.62,18.24 28.8,18.41 v29.84,18.41 | v8.13,27.05 6.78,27.05 U5.2
  Bottom 0.305: v18.8,16.26 18.8,14.35 16.89,12.45 14.86,12.45 12.57,10.16 12.57,8.13 7.49,3.05 v7.37,3.05
  Bottom 0.406: v29.84,18.41 31.19,19.76 31.19,24.21 27.84,27.56 10.67,27.56 10.16,27.05 v8.13,27.05
VO+
  Bottom 0.203: FB1.2 28.45,6.31 C13.1 26.66,8.08 21.18,8.08 20.34,8.91 20.34,9.25 19.96,9.63 19.96,9.65 19.86,9.75 16.46,9.75 15.21,8.51 SPK+.1
  Bottom 0.305: 15.21,8.2 SPK+.1
VO-
  Bottom 0.152: 18.95,7.11 18.82,6.99 SPK-.1
  Bottom 0.203: FB2.1 31.6,5.08 30.2,3.68 C14.1 27.66,4.44 26.7,4.44 25.7,5.44 25.7,5.67 24.76,6.6 SPK-.1
  Bottom 0.305: 19.93,7.11 18.95,7.11
VSW  (via drill 0.35)
  Top 0.305: U$2.2 1.57,4.83 v4.06,4.83 | v28.57,15.75 29.52,15.75 U2.3
  Top 0.406: U$2.2 1.09,5.06 R20.2
  Bottom 0.305: v4.06,4.83 6.45,2.44 7.62,2.44 8.22,3.05 8.26,3.05 13.08,7.87 13.08,9.91 15.16,11.99 17.08,11.99 20.84,15.75 v28.57,15.75
VUSB
  Top 0.305: U$1.2 14.05,17.65 9.73,17.65 8.65,18.73 J1.VBUS1 6.66,18.73 6.16,18.22 4.95,17.02 4.95,14.73 5.67,14.02 6.44,14.02 6.63,13.83 J1.VBUS2
  Top 0.406: C8.1 4.5,37.55 U4.4 5.15,37.65 5.88,36.92 R15.2 5.88,32.85 6.49,32.25 R16.2 6.48,30.48 U5.1 4.9,29.29 4.32,28.7 4.32,22.23 5.08,21.46 5.08,19.85 5.49,19.44 5.49,18.89 5.89,18.49 5.9,18.49 6.16,18.22

### Text on the board
tPlace: KeyBoy / ESP32-S3 | RST | OFF | Bt | ON
bPlace: 1.3" TFT | AUDIO / On | B | U | A | R | L | D | SEL | SPEAKER